# Altium project x-IMU3-SA-GPS.PrjPcb
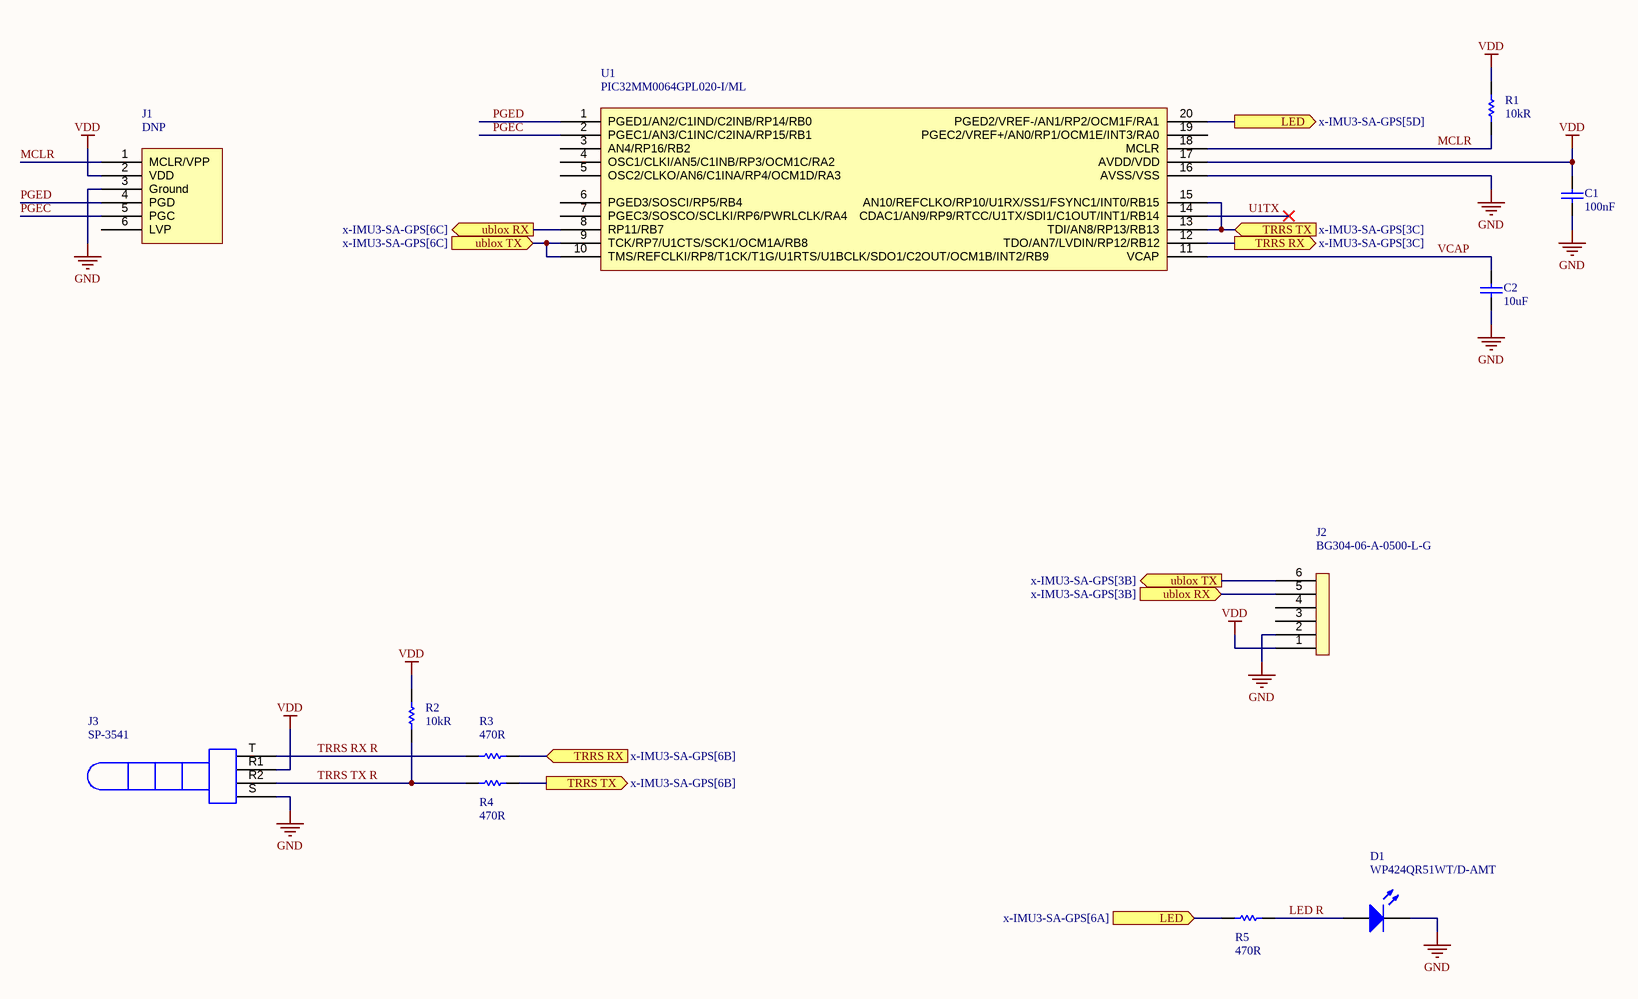
[diagram p0: x-IMU3-SA-GPS.SchDoc]
Version: v1.1; Project: x-IMU3-SA-GPS; Author: Seb Madgwick
1 sheet, 12 parts. Net scope: flat (ports and power ports of the same name join across sheets).
Board file: x-IMU3-SA-GPS.PcbDoc

## Sheet x-IMU3-SA-GPS.SchDoc
size A3; SheetNumber: 1; SheetTotal: 1

### Parts
C1  100nF  [Capacitor 0402]
C2  10uF  [Capacitor 0402]
D1  WP424QR51WT/D-AMT  [LED 3mm]
J1  DNP  [Tag Connect No Legs]
J2  BG304-06-A-0500-L-G  [BG304-06-A-0500-L-G]
J3  SP-3541  [SP-3541]
R1  10kR  [Resistor 0402]
R2  10kR  [Resistor 0402]
R3  470R  [Resistor 0402]
R4  470R  [Resistor 0402]
R5  470R  [Resistor 0402]
U1  PIC32MM0064GPL020-I/ML  [QFN-20]

### Ports
LED (in, see x-IMU3-SA-GPS[6A]), LED (out, see x-IMU3-SA-GPS[5D]), TRRS RX (in, see x-IMU3-SA-GPS[6B]), TRRS RX (out, see x-IMU3-SA-GPS[3C]), TRRS TX (in, see x-IMU3-SA-GPS[3C]), TRRS TX (out, see x-IMU3-SA-GPS[6B]), ublox RX (in, see x-IMU3-SA-GPS[3B]), ublox RX (out, see x-IMU3-SA-GPS[6C]), ublox TX (in, see x-IMU3-SA-GPS[6C]), ublox TX (out, see x-IMU3-SA-GPS[3B])

### Nets
GND: C1.1 C2.1 D1.K J1.3(Ground) J2.2 J3.S U1.16(AVSS/VSS)
VDD: C1.2 J1.2(VDD) J2.1 J3.R1 R1.2 R2.2 U1.17(AVDD/VDD)
LED: R5.2 U1.20(PGED2/VREF-/AN1/RP2/OCM1F/RA1) ; port LED
LED R: D1.A R5.1
MCLR: J1.1(MCLR/VPP) R1.1 U1.18(MCLR)
PGEC: J1.5(PGC) U1.2(PGEC1/AN3/C1INC/C2INA/RP15/RB1)
PGED: J1.4(PGD) U1.1(PGED1/AN2/C1IND/C2INB/RP14/RB0)
TRRS RX: R3.1 U1.12(TDO/AN7/LVDIN/RP12/RB12) ; port TRRS RX
TRRS RX R: J3.T R3.2
TRRS TX: R4.1 U1.13(TDI/AN8/RP13/RB13) U1.15(AN10/REFCLKO/RP10/U1RX/SS1/FSYNC1/INT0/RB15) ; port TRRS TX
TRRS TX R: J3.R2 R2.1 R4.2
U1TX: U1.14(CDAC1/AN9/RP9/RTCC/U1TX/SDI1/C1OUT/INT1/RB14)
ublox RX: J2.5 U1.8(RP11/RB7) ; port ublox RX
ublox TX: J2.6 U1.9(TCK/RP7/U1CTS/SCK1/OCM1A/RB8) U1.10(TMS/REFCLKI/RP8/T1CK/T1G/U1RTS/U1BCLK/SDO1/C2OUT/OCM1B/INT2/RB9) ; port ublox TX
VCAP: C2.2 U1.11(VCAP)

Not connected (* = marked no-connect by the designer): J1 6(LVP); J2 3 4; U1 3(AN4/RP16/RB2) 4(OSC1/CLKI/AN5/C1INB/RP3/OCM1C/RA2) 5(OSC2/CLKO/AN6/C1INA/RP4/OCM1D/RA3) 6(PGED3/SOSCI/RP5/RB4) 7(PGEC3/SOSCO/SCLKI/RP6/PWRLCLK/RA4) 19(PGEC2/VREF+/AN0/RP1/OCM1E/INT3/RA0)

### Notes on the sheet
- TITLE
- SIZE
- A3
- VARIANT
- PROJECT
- SHEET
- VERSION
- OF
- AUTHOR
- DATE

### Library data of the parts
C1 C2 = Capacitor
D1 = LED
J1 = MPLAB ICSP
R1-R5 = Resistor